# EAGLE schematic H1DR0x-AD (EAGLE 9.6.1)
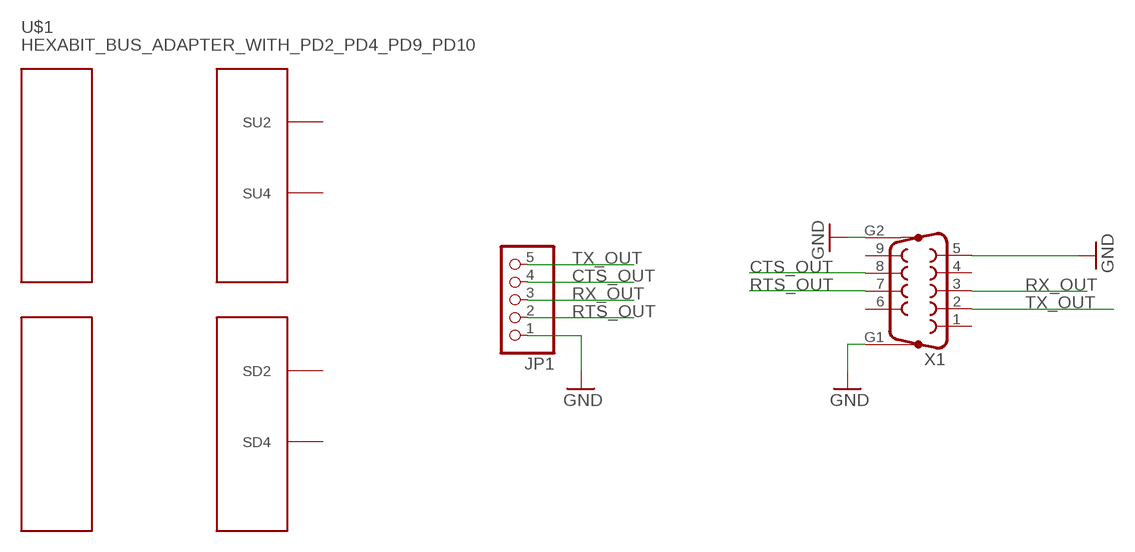
[diagram p0: schematic, sheet 1]

## Parts
JP1  PINHD-1X5  [F_1X05]
U$1  HEXABIT_BUS_ADAPTER_WITH_PD2_PD4_PD9_PD10  [HEXABIT_BUS_ADAPTER_WITH_P2_P4]
X1  F09HP  [F09HP]

## Nets
CTS_OUT: JP1.4 X1.8
GND: JP1.1 X1.5 X1.G1 X1.G2
RTS_OUT: JP1.2 X1.7
RX_OUT: JP1.3 X1.3
TX_OUT: JP1.5 X1.2
Unconnected: U$1.PAD_PD2(SD2) U$1.PAD_PD4(SD4) U$1.PAD_PU2(SU2) U$1.PAD_PU4(SU4) X1.1 X1.4 X1.6 X1.9

## Library data of the parts
JP1 = Hexabitz:PINHD-1X5: PIN HEADER Female right angle; DESCRITION: Female, 5C, Rt Angle .100"CC; 3.15mm Tail, No Mt. 100u" Tin; PBT, Phos Bronze, 105 C; MFN: Sullins; MPN: PPTC051LGBN-RC; OCTOPART_URL: https://octopart.com/pptc051lgbn-rc-sullins-270345?r=sp
U$1 = hexabitz_connectors:HEXABIT_BUS_ADAPTER_WITH_PD2_PD4_PD9_PD10
X1 = Hexabitz:F09HP: SUB-D; DESCRITION: 9 Position Dual Row Right Angle Through Hole Plug Male Pins D-Sub Connector; MFN: ASSMANN WSW Components; MPN: A-DS-09-A/KG-T2S; OCTOPART_URL: https://octopart.com/a-ds-09-a%2Fkg-t2s-assmann+wsw+components-56465222?r=sp; OC_FARNELL: unknown; OC_NEWARK: unknown